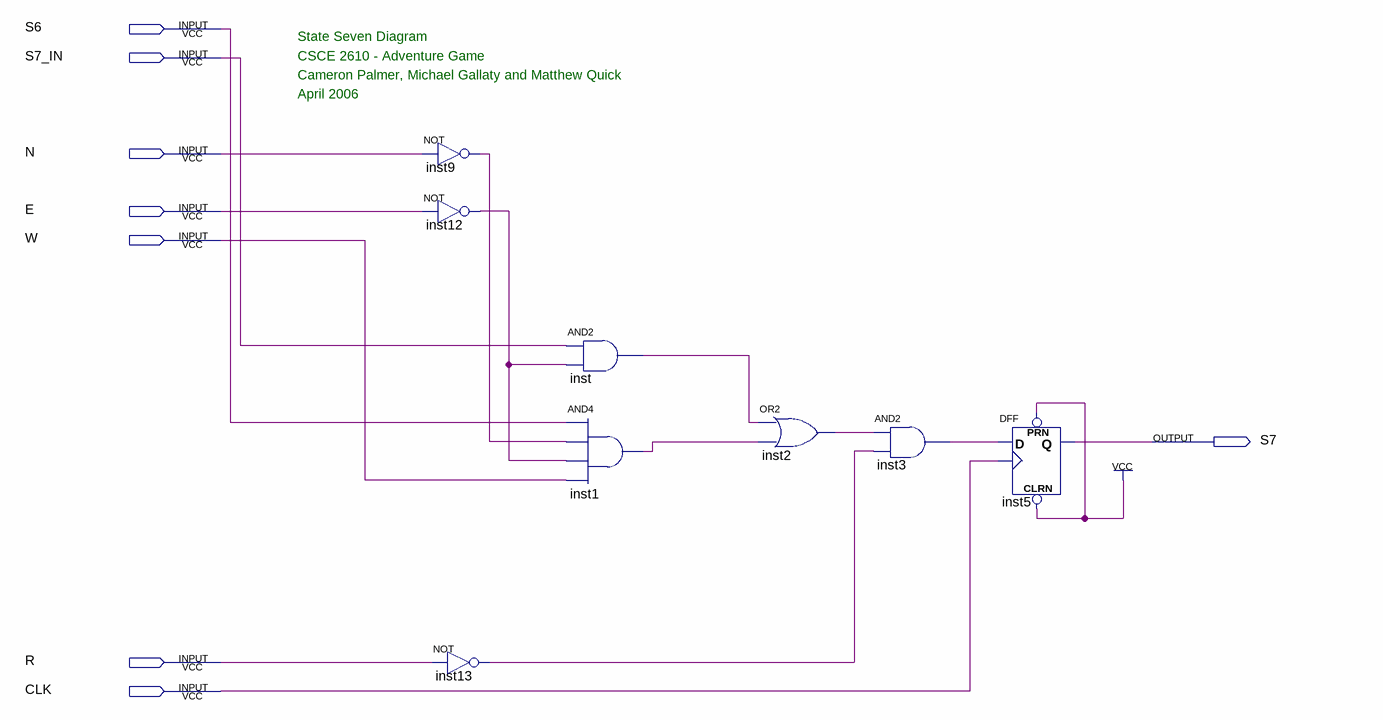
[diagram p0: schematic sheet]
// Quartus schematic state_seven.bdf as structural Verilog: 8 symbols, 8 pins
module state_seven (
  input  S6,
  input  S7_IN,
  input  N,
  input  E,
  input  W,
  input  R,
  input  CLK,
  output S7
);

  wire inst1_out, inst2_out, inst3_out, inst9_out, inst12_out, inst13_out, inst_out;

  not inst9 (inst9_out, N);
  not inst12 (inst12_out, E);
  not inst13 (inst13_out, R);
  and inst (inst_out, S7_IN, inst12_out);
  and inst1 (inst1_out, S6, inst9_out, inst12_out, W);
  or inst2 (inst2_out, inst_out, inst1_out);
  and inst3 (inst3_out, inst2_out, inst13_out);
  DFF inst5 (.CLRN(1'b1), .CLK(CLK), .D(inst3_out), .PRN(1'b1), .Q(S7));

  // Notes on the sheet:
  //   State Seven Diagram
  //   CSCE 2610 - Adventure Game
  //   Cameron Palmer, Michael Gallaty and Matthew Quick
  //   April 2006
endmodule
